# Altium schematic sheet Sheet3.SchDoc
size A4
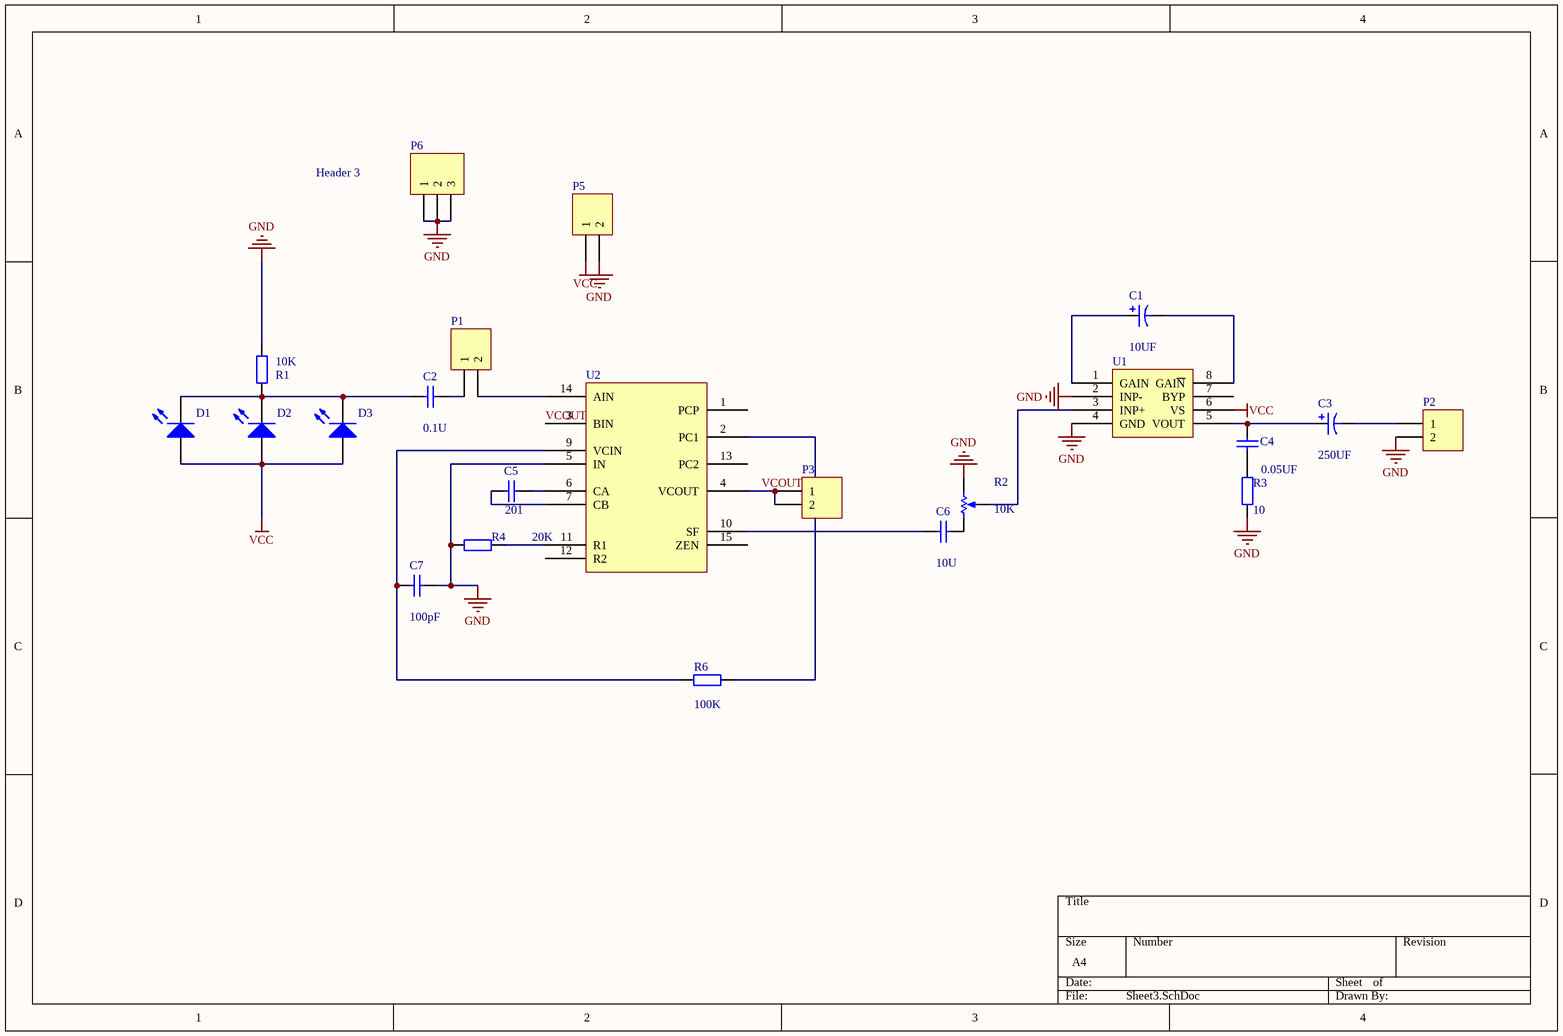
[diagram p0: Sheet3.SchDoc]

## Parts
C1  value 10UF  [B]  (hidden comment: Cap Pol1)
C2  value 0.1U  [AXIAL-0.4]  (hidden comment: Cap)
C3  value 250UF  [B]  (hidden comment: Cap Pol1)
C4  value 0.05UF  [6-0805]  (hidden comment: Cap)
C5  value 201  [6-0805]  (hidden comment: Cap)
C6  value 10U  [CAPPR5-5x5]  (hidden comment: Cap)
C7  value 100pF  [CAPPR5-5x5]  (hidden comment: Cap)
D1  LED0  [LED-0]  (value not drawn)
D2  LED0  [LED-0]  (value not drawn)
D3  LED0  [LED-0]  (value not drawn)
P1  Header 2  [HDR1X2]  (value not drawn)
P2  Header 2  [HDR1X2]  (value not drawn)
P3  Header 2  [HDR1X2]  (value not drawn)
P5  Header 2  [HDR1X2]  (value not drawn)
P6  Header 3  [HDR1X3]
R1  value 10K  [6-0805]  (hidden comment: Res2)
R2  value 10K  [HDR1X3]
R3  value 10  [6-0805]  (hidden comment: Res2)
R4  value 20K  [6-0805]  (hidden comment: Res2)
R6  value 100K  [6-0805]  (hidden comment: Res2)
U1  LM386  [DIP-8]  (value not drawn)
U2  CD4046  [DIP-16]  (value not drawn)

## Nets
GND: C7.2 P2.2 P5.2 P6.1 P6.2 P6.3 R1.2 R2.3(BOT) R3.2 R4.2 U1.2(INP-) U1.4(GND) U2.5(IN)
VCC: D1.1(A) D2.1(A) D3.1(A) P5.1 U1.6(VS)
VCOUT: P3.1 P3.2 U2.3(BIN) U2.4(VCOUT)
NetC1_1: C1.1 U1.1(GAIN)
NetC1_2: C1.2 U1.8(GAI~{N})
NetC2_1: C2.1 D1.2(K) D2.2(K) D3.2(K) R1.1
NetC2_2: C2.2 P1.1
NetC3_1: C3.1 C4.2 U1.5(VOUT)
NetC3_2: C3.2 P2.1
NetC4_1: C4.1 R3.1
NetC5_1: C5.1 U2.7(CB)
NetC5_2: C5.2 U2.6(CA)
NetC6_1: C6.1 U2.10(SF)
NetC6_2: C6.2 R2.1(TOP)
NetC7_1: C7.1 R6.2 U2.9(VCIN)
NetP1_2: P1.2 U2.14(AIN)
NetR2_2: R2.2(TAP) U1.3(INP+)
NetR4_1: R4.1 U2.11(R1)
NetR6_1: R6.1 U2.2(PC1)

Not connected (* = marked no-connect by the designer): U1 7(BYP); U2 1(PCP) 12(R2) 13(PC2) 15(ZEN)

## Library data of the parts
C1 C3 = Cap Pol1: Polarized Capacitor (Radial); Published: 8-Jun-2000; LatestRevisionDate: 17-Jul-2002; LatestRevisionNote: Re-released for DXP Platform.; PackageReference: RB7.6-15; Publisher: Altium Limited
C2 C4-C7 = Cap: Capacitor; Published: 8-Jun-2000; LatestRevisionDate: 17-Jul-2002; LatestRevisionNote: Re-released for DXP Platform.; PackageReference: RAD-0.3; Publisher: Altium Limited
D1-D3 = LED0: Typical INFRARED GaAs LED; Published: 8-Jun-2000; LatestRevisionDate: 08-Jul-2005; LatestRevisionNote: Mech Layer 1 removed.; PackageReference: LED-0; Publisher: Altium Limited
P1-P3 P5 = Header 2: Header, 2-Pin; LatestRevisionDate: 17-Jul-2002; LatestRevisionNote: Re-released for DXP Platform.; Publisher: Altium Limited
P6 = Header 3: Header, 3-Pin; LatestRevisionDate: 17-Jul-2002; LatestRevisionNote: Re-released for DXP Platform.; Publisher: Altium Limited
R1 R3 R4 R6 = Res2: Resistor; Published: 8-Jun-2000; LatestRevisionDate: 17-Jul-2002; LatestRevisionNote: Re-released for DXP Platform.; PackageReference: AXIAL-0.4; Publisher: Altium Limited
R2 = RPot: Potentiometer; Sim Note: Enter the Resistance value and the set point into parameter fields.; Set Position: 0.5; Published: 8-Jun-2000; LatestRevisionDate: 17-Jul-2002; LatestRevisionNote: Re-released for DXP Platform.; PackageReference: VR5; Publisher: Altium Limited
U2 = Component_1